# EAGLE design slide-control (EAGLE 9.6.2)
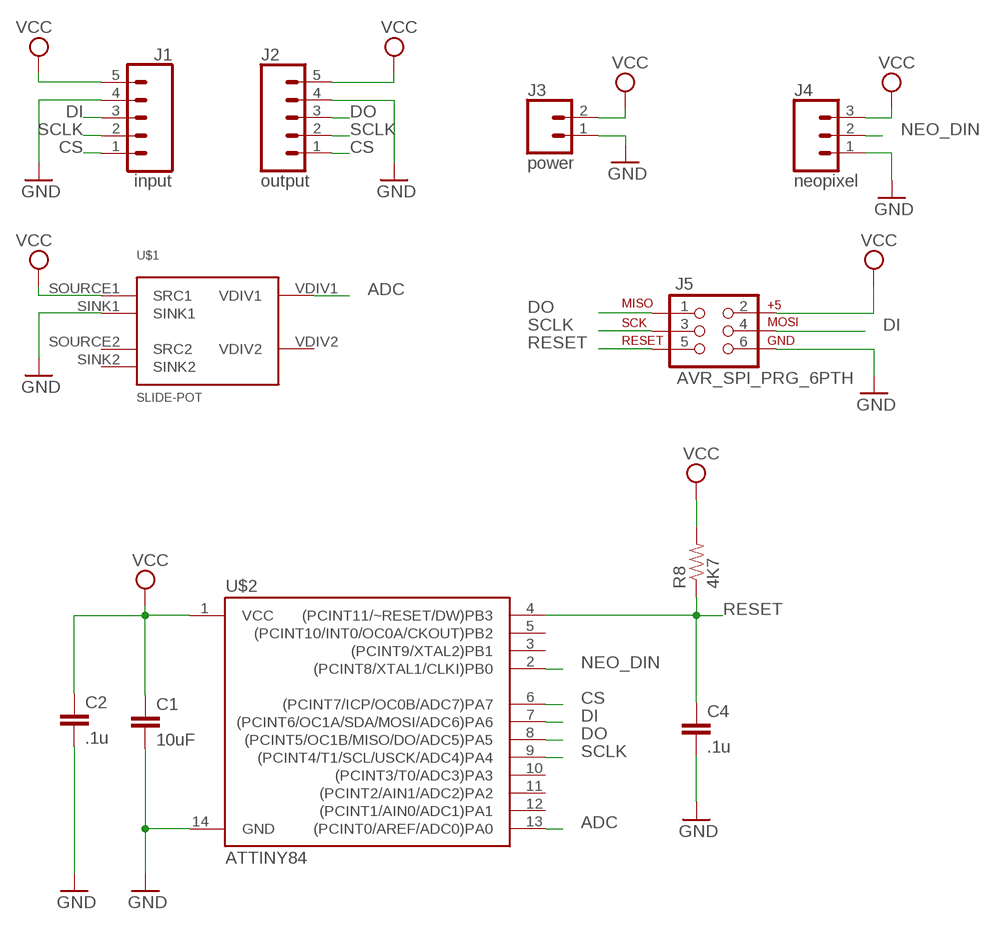
[diagram p0: schematic, sheet 1]

## Parts
C1  10uF  10UF-1206-6.3V-20%  [1206]
C2  .1u  CAP0805  [0805]
C4  .1u  CAP0805  [0805]
J1  input  CONN_05  [1X05]
J2  output  CONN_05  [1X05]
J3  power  CONN_02  [1X02]
J4  neopixel  CONN_03  [1X03]
J5  AVR_SPI_PRG_6PTH  [2X3]
R8  4K7  RESISTOR  [0805]
U$1  SLIDE-POT  [SLIDE-POT]
U$2  ATTINY84  [SO14]

## Nets
ADC: U$1.VDIV1 U$2.13((PCINT0/AREF/ADC0)PA0)
CS: J1.1 J2.1 U$2.6((PCINT7/ICP/OC0B/ADC7)PA7)
DI: J1.3 J5.4 U$2.7((PCINT6/OC1A/SDA/MOSI/ADC6)PA6)
DO: J2.3 J5.1 U$2.8((PCINT5/OC1B/MISO/DO/ADC5)PA5)
GND: C1.2 C2.2 C4.2 J1.4 J2.4 J3.1 J4.1 J5.6 U$1.SINK1 U$2.14(GND)
NEO_DIN: J4.2 U$2.2((PCINT8/XTAL1/CLKI)PB0)
RESET: C4.1 J5.5 R8.1 U$2.4((PCINT11/~RESET/DW)PB3)
SCLK: J1.2 J2.2 J5.3 U$2.9((PCINT4/T1/SCL/USCK/ADC4)PA4)
VCC: C1.1 C2.1 J1.5 J2.5 J3.2 J4.3 J5.2 R8.2 U$1.SOURCE1(SRC1) U$2.1(VCC)
Unconnected: U$1.SINK2 U$1.SOURCE2(SRC2) U$1.VDIV2 U$2.3((PCINT9/XTAL2)PB1) U$2.5((PCINT10/INT0/OC0A/CKOUT)PB2) U$2.10((PCINT3/T0/ADC3)PA3) U$2.11((PCINT2/AIN1/ADC2)PA2) U$2.12((PCINT1/AIN0/ADC1)PA1)

## Library data of the parts
C1 = SparkFun-Capacitors:10UF: 10.0µF ceramic capacitors A capacitor is a passive two-terminal electrical component used to store electrical energy temporarily in an electric field.; PROD_ID: CAP-10057
C2 C4 = SparkFun:CAP: Capacitor Standard 0603 ceramic capacitor, and 0.1" leaded capacitor.
J1 J2 = SparkFun-Connectors:CONN_05: Multi connection point. Often used as Generic Header-pin footprint for 0.1 inch spaced/style header connections On any of the 0.1 inch spaced packages, you can populate with these: Break Away Headers - Straight <https://www.sparkfun.com/products/116> (PRT-00116) Break Away Male Headers - Right Angle <https://www.sparkfun.com/products/553> (PRT-00553) Female Headers <https://www.sparkfun.com/products/115> (PRT-00115) Break Away Headers - Machine Pin <https://www.sparkfun.com/products/117> (PRT-00117) Break Away Female Headers - Swiss Machine Pin <https://www.sparkfun.com/products/743> (PRT-00743) For SCREWTERMINALS and SPRING TERMINALS visit here: Screw Terimnals on SparkFun.com <https://www.sparkfun.com/search/results?term=Screw+Terminals> (5mm/3.5mm/2.54mm spacing) This device is also useful as a general connection point to wire up your design to another part of your project. Our various solder wires solder well into these plated through hole pads. Hook-Up Wire - Assortment (Stranded, 22 AWG) <https://www.sparkfun.com/products/11375> (PRT-11375) Hook-Up Wire - Assortment (Solid Core, 22 AWG) <https://www.sparkfun.com/products/11367> (PRT-11367) View the entire wire category on our website here <https://www.sparkfun.com/categories/141> Special notes: Molex polarized connector foot print use with SKU : PRT-08231 with associated crimp pins and housings. 1MM SMD Version SKU: PRT-10208
J3 = SparkFun-Connectors:CONN_02: Multi connection point. Often used as Generic Header-pin footprint for 0.1 inch spaced/style header connections On any of the 0.1 inch spaced packages, you can populate with these: Break Away Headers - Straight <https://www.sparkfun.com/products/116> (PRT-00116) Break Away Male Headers - Right Angle <https://www.sparkfun.com/products/553> (PRT-00553) Female Headers <https://www.sparkfun.com/products/115> (PRT-00115) Break Away Headers - Machine Pin <https://www.sparkfun.com/products/117> (PRT-00117) Break Away Female Headers - Swiss Machine Pin <https://www.sparkfun.com/products/743> (PRT-00743) For SCREWTERMINALS and SPRING TERMINALS visit here: Screw Terimnals on SparkFun.com <https://www.sparkfun.com/search/results?term=Screw+Terminals> (5mm/3.5mm/2.54mm spacing) This device is also useful as a general connection point to wire up your design to another part of your project. Our various solder wires solder well into these plated through hole pads. Hook-Up Wire - Assortment (Stranded, 22 AWG) <https://www.sparkfun.com/products/11375> (PRT-11375) Hook-Up Wire - Assortment (Solid Core, 22 AWG) <https://www.sparkfun.com/products/11367> (PRT-11367) View the entire wire category on our website here <https://www.sparkfun.com/categories/141> Special notes: Molex polarized connector foot print use with: PRT-08233 with associated crimp pins and housings. 2.54_SCREWTERM for use with PRT-10571. 3.5mm Screw Terminal footprints for PRT-08084 5mm Screw Terminal footprints for use with PRT-08432
J4 = SparkFun-Connectors:CONN_03: Multi connection point. Often used as Generic Header-pin footprint for 0.1 inch spaced/style header connections On any of the 0.1 inch spaced packages, you can populate with these: Break Away Headers - Straight <https://www.sparkfun.com/products/116> (PRT-00116) Break Away Male Headers - Right Angle <https://www.sparkfun.com/products/553> (PRT-00553) Female Headers <https://www.sparkfun.com/products/115> (PRT-00115) Break Away Headers - Machine Pin <https://www.sparkfun.com/products/117> (PRT-00117) Break Away Female Headers - Swiss Machine Pin <https://www.sparkfun.com/products/743> (PRT-00743) Stackable Header - 3 Pin (Female, 0.1") <https://www.sparkfun.com/products/13875> (PRT-13875) For SCREWTERMINALS and SPRING TERMINALS visit here: Screw Terimnals on SparkFun.com <https://www.sparkfun.com/search/results?term=Screw+Terminals> (5mm/3.5mm/2.54mm spacing) This device is also useful as a general connection point to wire up your design to another part of your project. Our various solder wires solder well into these plated through hole pads. Hook-Up Wire - Assortment (Stranded, 22 AWG) <https://www.sparkfun.com/products/11375> (PRT-11375) Hook-Up Wire - Assortment (Solid Core, 22 AWG) <https://www.sparkfun.com/products/11367> (PRT-11367) View the entire wire category on our website here <https://www.sparkfun.com/categories/141> Special notes: Molex polarized connector foot print use with SKU : PRT-08232 with associated crimp pins and housings.
J5 = SparkFun-Connectors:AVR_SPI_PRG_6: AVR ISP 6 Pin This is the reduced ISP connector for AVR programming. Common on Arduino. This footprint will take up less PCB space and can be used with a 10-pin to 6-pin adapter such as SKU: BOB-08508
R8 = SparkFun:RESISTOR: Resistor Basic schematic elements and footprints for 0603, 1206, and PTH 1/10th watt (small) resistors.
U$1 = GARTH:SLIDE-POT
U$2 = SparkFun-IC-Microcontroller:ATTINY84: Atmel 14-pin 2/4/8kB flash uC Datasheet <https://cdn.sparkfun.com/datasheets/Widgets/doc8006.pdf> SparkFun Products Tiny AVR Programmer <https://www.sparkfun.com/products/11801> (PGM-11801) SparkFun Servo Trigger - Continuous Rotation <https://www.sparkfun.com/products/13872> (WIG-13872) SparkFun Servo Trigger <https://www.sparkfun.com/products/13118> (WIG-13118); PROD_ID: IC-11285

## Board
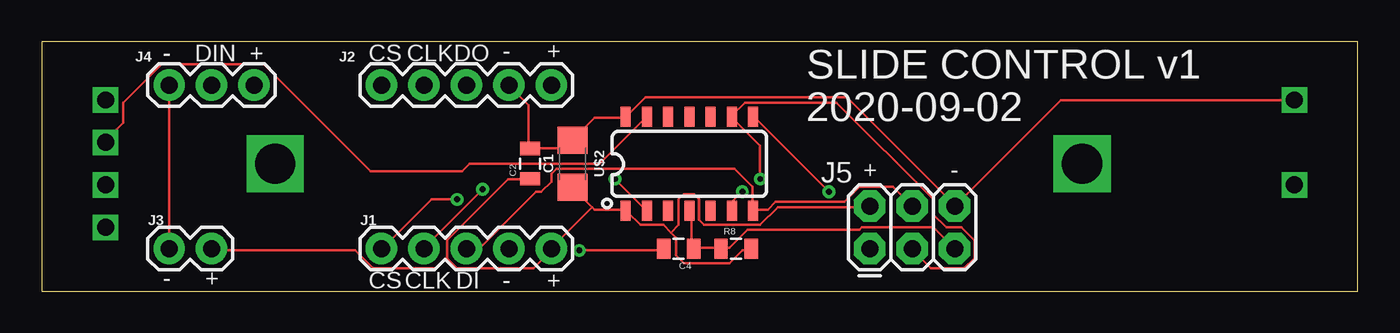
[diagram p1: board, top side]
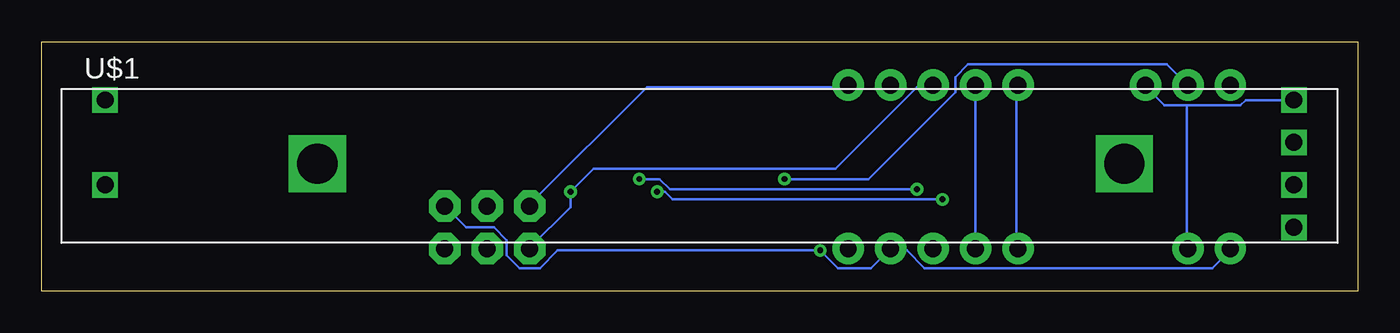
[diagram p2: board, bottom side, seen from below]

Size 78.72 x 14.91 mm. Coordinates in mm from the lower left corner, seen from the top.
Outline: 0,0 78.72,0 78.72,14.91 0,14.91 0,0
Copper layers (1*16): Top 0.035mm / dielectric 1.5mm / Bottom 0.035mm
Design rules "default": minimum track width 6mil, minimum drill 0.35mm, track to track 6mil, track to pad 6mil, pad to pad 6mil, via to via 6mil, smd to smd 6mil, copper to edge 40mil, drill to drill 6mil, minimum pad ring 10mil, minimum via ring 8mil, stop-mask expansion 4mil, vias tented up to drill 0mil, thermal gap 10mil

### Footprints (pad centres in the part's own frame; a part is rotated, then mirrored left to right if it is on the bottom)
1206 = smd 1.6 x 1.8: 1 -1.4,0; 2 1.4,0
0805 = smd 0.8 x 1.2: 1 -0.9,0; 2 0.9,0
1X05 = drill 1.016 pad 1.88: 1 0,0; 2 2.54,0; 3 5.08,0; 4 7.62,0; 5 10.16,0
1X02 = drill 1.016 pad 1.88: 1 0,0; 2 2.54,0
1X03 = drill 1.016 pad 1.88: 1 0,0; 2 2.54,0; 3 5.08,0
2X3 = drill 1.016 pad 1.88 octagon: 1 0,0; 2 0,2.54; 3 2.54,0; 4 2.54,2.54; 5 5.08,0; 6 5.08,2.54
SLIDE-POT = drill 2.4 square: P$7 12.7,-3.81; P$8 60.96,-3.81 | drill 1.016 square: SINK1 0,0; SINK2 0,-5.08; SOURCE1 71.12,0; SOURCE2 71.12,-5.08; VDIV1 71.12,-2.54; VDIV2 71.12,-7.62
SO14 = smd 0.6 x 1.2: 1 -3.175,-2.8; 2 -1.905,-2.8; 3 -0.635,-2.8; 4 0.635,-2.8; 5 1.905,-2.8; 6 3.175,-2.8; 7 4.445,-2.8; 8 4.445,2.8; 9 3.175,2.8; 10 1.905,2.8; 11 0.635,2.8; 12 -0.635,2.8; 13 -1.905,2.8; 14 -3.175,2.8

### Placement (x,y rotation side)
C1  31.75,7.62 90 top
C2  29.21,7.62 90 top
C4  38.1,2.54 180 top
J1  20.32,2.54 0 top
J2  20.32,12.32 0 top
J3  7.62,2.54 0 top
J4  7.62,12.32 0 top
J5  49.53,2.54 0 top
R8  41.53,2.54 0 top
U$1  74.93,11.43 0 bottom
U$2  38.1,7.62 0 top

### Tracks (layer width: path | path; a pad name or v marks a point on that pad's centre or on a via)
ADC
  Top 0.152: U$2.13 36.12,10.36 33.38,7.62 25.6,7.62 25.15,7.16 19.66,7.16 13.26,13.56 7.16,13.56 4.88,11.28 4.88,10.06 3.81,8.99 U$1.VDIV1
CS  (via drill 0.35)
  Top 0.152: v41.91,5.94 41.3,5.33 41.3,4.88 U$2.6 | v24.84,5.49 23.32,5.49 20.42,2.59 J1.1
  Bottom 0.152: v41.91,5.94 41.45,5.94 41,5.49 v24.84,5.49 | J2.1 20.42,12.19 20.42,2.59 J1.1
DI
  Top 0.152: J5.4 50.9,6.25 48.92,6.25 48.01,5.33 43.89,5.33 43.43,4.88 42.67,4.88 U$2.7 42.52,4.88 42.52,6.25 41.45,7.32 30.79,7.32 30.48,7.01 30.48,6.55 29.87,5.94 29.57,5.94 26.21,2.59 25.45,2.59 J1.3
DO  (via drill 0.35)
  Top 0.152: v47.09,5.94 42.67,10.36 U$2.8
  Bottom 0.152: J5.1 49.53,2.59 47.09,5.03 v47.09,5.94 45.72,7.32 31.24,7.32 26.36,12.19 25.45,12.19 J2.3
GND  (via drill 0.35)
  Top 0.152: v32.16,2.44 37.19,2.44 C4.2 | J4.1 J3.1 | J2.4 28.04,12.19 29.11,11.12 29.11,8.53 C2.2 29.26,8.53 31.24,8.53 31.7,8.99 C1.2 31.85,9.14 33.07,10.36 34.9,10.36 U$2.14 35.05,10.52 36.12,11.58 48.16,11.58 54.56,5.18 J5.6 60.96,11.43 U$1.SINK1
  Bottom 0.152: J3.1 7.62,2.44 8.69,1.37 25.91,1.37 26.98,2.44 27.89,2.44 J1.4 29.11,1.37 31.09,1.37 v32.16,2.44 47.85,2.44 48.92,1.37 50.14,1.37 50.9,2.13 50.9,3.05 51.66,3.81 53.34,3.81 J5.6
NEO_DIN  (via drill 0.35)
  Top 0.152: v34.29,6.71 36.12,4.88 U$2.2
  Bottom 0.152: v34.29,6.71 29.26,6.71 24.08,11.89 24.08,12.8 23.32,13.56 11.43,13.56 10.21,12.34 J4.2
RESET
  Top 0.152: U$2.4 38.86,4.72 38.86,2.59 C4.1 39.01,2.59 40.54,2.59 R8.1 40.69,2.59 41.15,2.59 42.22,3.66 48.92,3.66 49.07,3.81 53.34,3.81 J5.5
SCLK  (via drill 0.35)
  Top 0.152: J5.3 52.12,2.44 53.19,1.37 55.17,1.37 55.78,1.98 55.78,3.05 55.02,3.81 54.1,3.81 53.34,4.57 53.34,5.49 47.55,11.28 42.06,11.28 41.3,10.52 U$2.9 41.3,10.36 42.98,8.69 v42.98,6.71 | v26.36,6.1 22.86,2.59 J1.2
  Bottom 0.152: J2.2 J1.2 | v26.36,6.1 41.15,6.1 41.76,6.71 v42.98,6.71
VCC
  Top 0.152: 24.23,1.98 24.23,3.05 27.89,6.71 29.11,6.71 C2.1 | 24.23,1.98 24.84,1.37 29.41,1.37 30.48,2.44 J1.5 30.48,2.59 32.92,5.03 | 32.92,5.03 31.85,6.1 C1.1 | 32.92,5.03 33.07,4.88 34.9,4.88 U$2.1 35.05,4.72 35.81,3.96 37.19,3.96 37.64,3.5 | 37.64,3.5 37.95,3.2 37.95,2.13 38.41,1.68 41.15,1.68 41.91,2.44 42.37,2.44 R8.2 | 37.64,3.5 38.1,3.96 38.1,5.49 38.41,5.79 39.01,5.79 39.32,5.49 39.32,4.27 39.62,3.96 42.98,3.96 44.04,5.03 49.53,5.03 J5.2 | 24.23,1.98 23.62,1.37 19.81,1.37 18.75,2.44 10.21,2.44 J3.2
  Bottom 0.152: U$1.SOURCE1 6.71,11.43 7.01,11.12 10.21,11.12 | 10.21,11.12 11.58,11.12 12.65,12.19 J4.3 | 10.21,11.12 10.21,2.59 J3.2 | J2.5 30.48,12.19 42.52,12.19 49.53,5.18 J5.2

### Text on the board
tPlace: - | - | DIN | + | + | CS | CLK | DO | - | + | SLIDE CONTROL v1 | 2020-09-02 | + | - | - | + | CS | CLK | DI | - | - | +